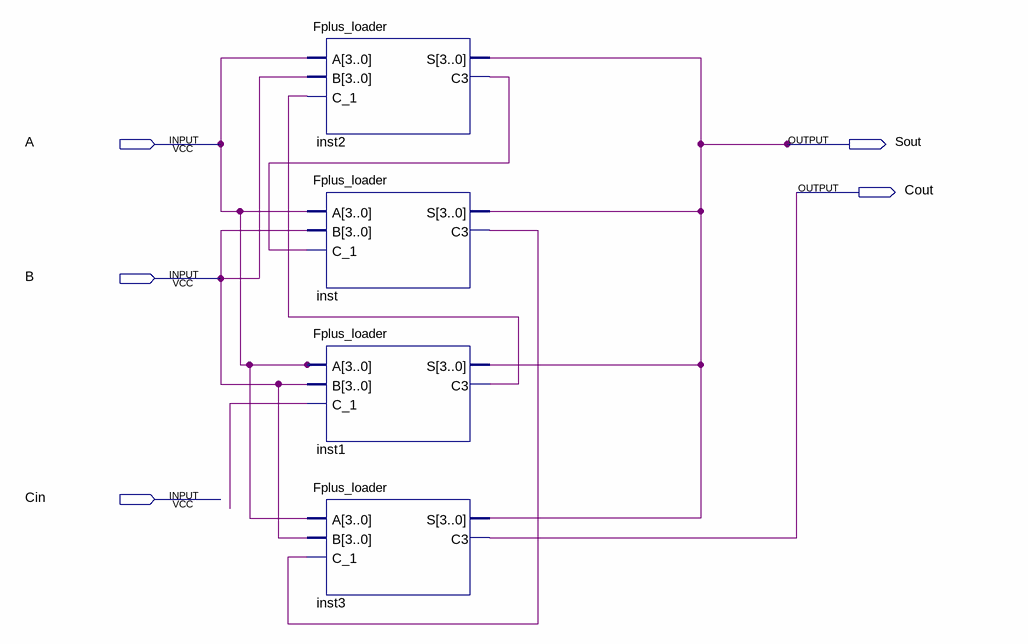
[diagram p0: schematic sheet]
// Quartus schematic Block3.bdf as structural Verilog: 4 symbols, 5 pins
module Block3 (
  input  A,
  input  B,
  input  Cin,
  output Sout,
  output Cout
);

  wire inst1_c3, inst2_c3, inst_c3, undriven;

  Fplus_loader inst2 (.A({4{A}}), .B({4{B}}), .C_1(inst1_c3), .S(Sout), .C3(inst2_c3));
  Fplus_loader inst (.A({4{A}}), .B({4{B}}), .C_1(inst2_c3), .S(Sout), .C3(inst_c3));
  Fplus_loader inst1 (.A({4{A}}), .B({4{B}}), .C_1(undriven), .S(Sout), .C3(inst1_c3));
  Fplus_loader inst3 (.A({4{A}}), .B({4{B}}), .C_1(inst_c3), .S(Sout), .C3(Cout));
endmodule
